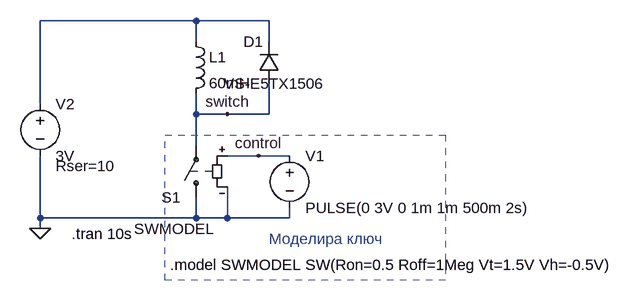
[diagram p0: schematic Diode-Inductor-Clamping.asc]
Diode-Inductor-Clamping.asc, the LTspice schematic file:
Version 4
SHEET 1 880 680
WIRE 128 48 -112 48
WIRE 240 48 128 48
WIRE 128 80 128 48
WIRE 240 80 240 48
WIRE -112 176 -112 48
WIRE 128 192 128 160
WIRE 176 192 128 192
WIRE 240 192 240 144
WIRE 240 192 176 192
WIRE 128 240 128 192
WIRE 224 256 176 256
WIRE 272 256 224 256
WIRE -112 352 -112 256
WIRE 128 352 128 320
WIRE 128 352 -112 352
WIRE 176 352 176 304
WIRE 176 352 128 352
WIRE 272 352 272 336
WIRE 272 352 176 352
WIRE -112 368 -112 352
FLAG -112 368 0
FLAG 224 256 control
FLAG 176 192 switch
SYMBOL voltage -112 160 R0
WINDOW 123 0 0 Left 0
WINDOW 39 24 112 Left 2
SYMATTR SpiceLine Rser=10
SYMATTR InstName V2
SYMATTR Value 3V
SYMBOL ind 112 64 R0
SYMATTR InstName L1
SYMATTR Value 60mH
SYMBOL sw 128 336 R180
WINDOW 3 -28 -33 Left 2
SYMATTR Value SWMODEL
SYMATTR InstName S1
SYMBOL voltage 272 240 R0
WINDOW 123 0 0 Left 0
WINDOW 39 0 0 Left 0
SYMATTR InstName V1
SYMATTR Value PULSE(0 3V 0 1m 1m 500m 2s)
SYMBOL diode 256 144 R180
WINDOW 0 24 64 Left 2
WINDOW 3 -69 -1 Left 2
SYMATTR InstName D1
SYMATTR Value VS-E5TX1506
TEXT -64 376 Left 2 !.tran 10s
TEXT 88 424 Left 2 !.model SWMODEL SW(Ron=0.5 Roff=1Meg Vt=1.5V Vh=-0.5V)
TEXT 240 384 Left 2 ;Моделира ключ
RECTANGLE Normal 512 448 80 224 2

The netlist it stands for:
* Diode-Inductor-Clamping.asc
V2 N001 0 3V Rser=10
L1 N001 switch 60mH
S1 0 switch control 0 SWMODEL
V1 control 0 PULSE(0 3V 0 1m 1m 500m 2s)
D1 switch N001 VS-E5TX1506
.model D D
.lib standard.dio
.tran 10s
.model SWMODEL SW(Ron=0.5 Roff=1Meg Vt=1.5V Vh=-0.5V)
* Моделира ключ
.backanno
.end